# EAGLE design Logic_board (EAGLE 8.2.1)
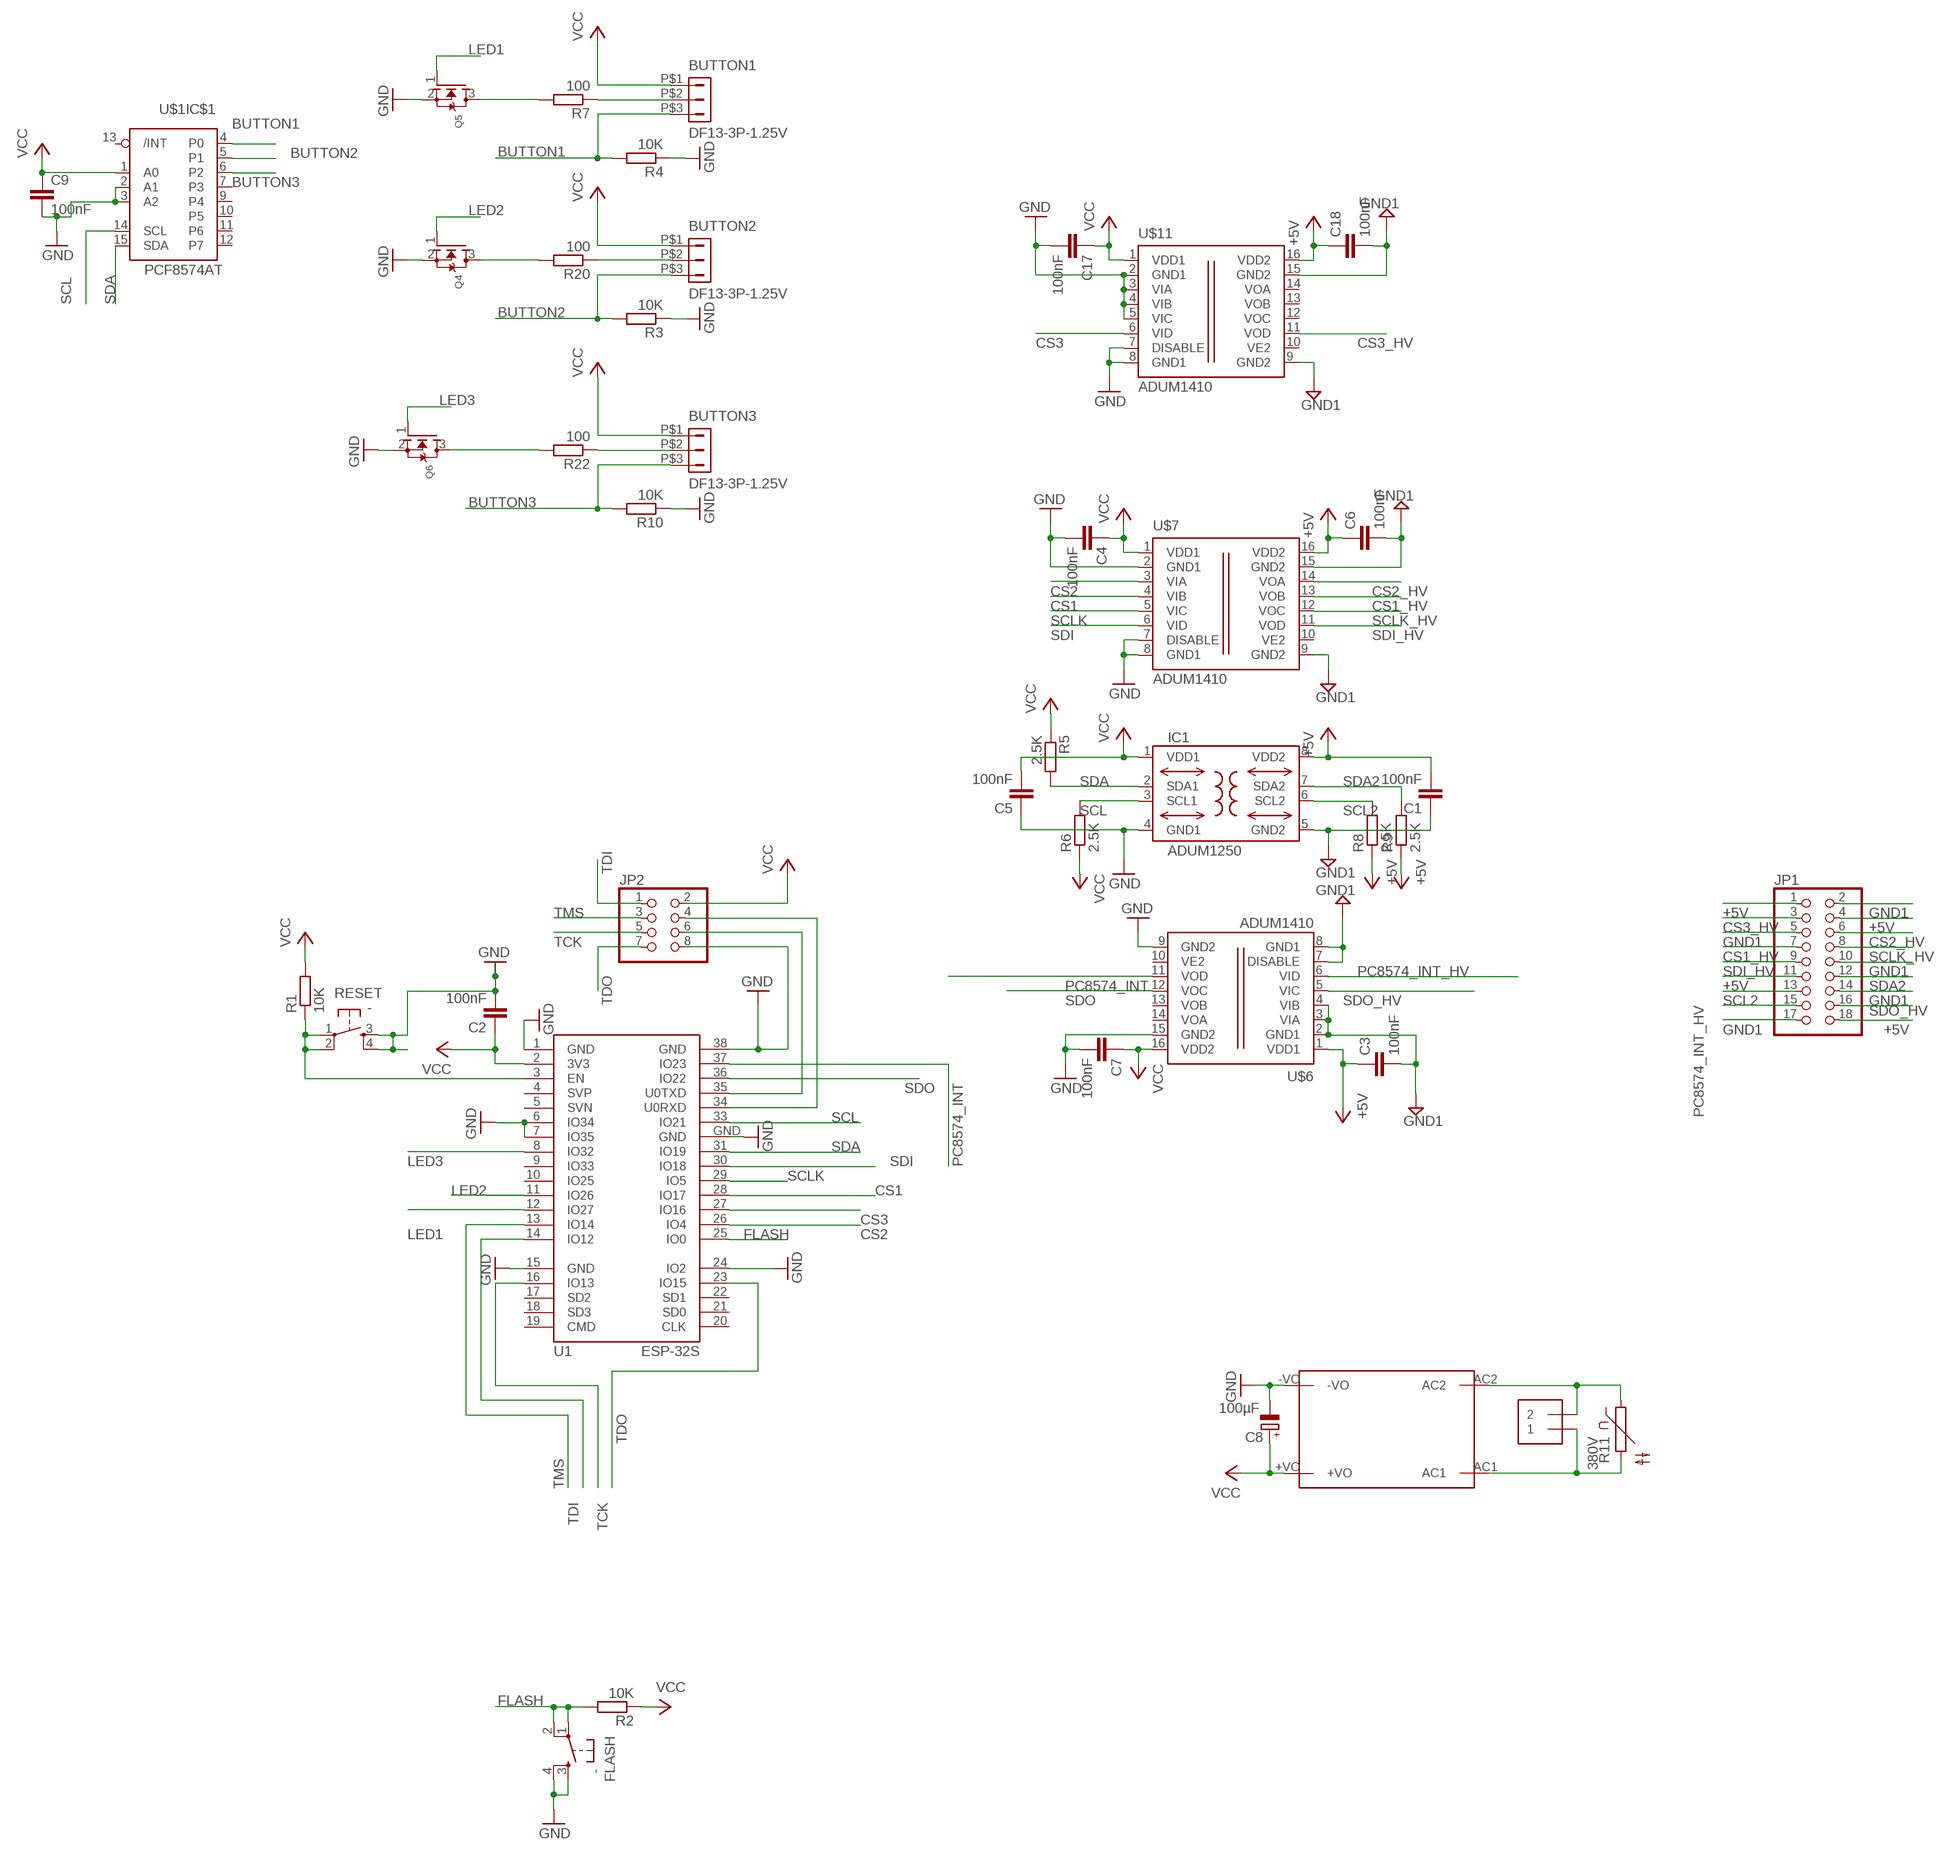
[diagram p0: schematic, sheet 1]

## Parts
BUTTON1  DF13-3P-1.25V  [DF13C-3P-1.25V]
BUTTON2  DF13-3P-1.25V  [DF13C-3P-1.25V]
BUTTON3  DF13-3P-1.25V  [DF13C-3P-1.25V]
C1  100nF  C-EUC0805  [C0805]
C2  100nF  C-EUC0805  [C0805]
C3  100nF  C-EUC0805  [C0805]
C4  100nF  C-EUC0805  [C0805]
C5  100nF  C-EUC0805  [C0805]
C6  100nF  C-EUC0805  [C0805]
C7  100nF  C-EUC0805  [C0805]
C8  100µF  CPOL-EUE2.5-6  [E2,5-6]
C9  100nF  C-EUC0805  [C0805]
C17  100nF  C-EUC0805  [C0805]
C18  100nF  C-EUC0805  [C0805]
FLASH  -  DTSM-6  [DTSM-6]
IC1  ADUM1250  [SO8-COOL]
J1  1X2-3.5MM  [1X2-3.5MM]
JP1  PINHD-2X9  [2X09]
JP2  PINHD-2X4  [2X04]
Q4  MOSFET-NREFLOW  [SOT23]
Q5  MOSFET-NREFLOW  [SOT23]
Q6  MOSFET-NREFLOW  [SOT23]
R1  10K  R-EU_R0805  [R0805]
R2  10K  R-EU_R0805  [R0805]
R3  10K  R-EU_R0805  [R0805]
R4  10K  R-EU_R0805  [R0805]
R5  2.5K  R-EU_R0805  [R0805]
R6  2.5K  R-EU_R0805  [R0805]
R7  100  R-EU_R0805  [R0805]
R8  2.5K  R-EU_R0805  [R0805]
R9  2.5K  R-EU_R0805  [R0805]
R10  10K  R-EU_R0805  [R0805]
R11  380V  S14K11  [S14K11]
R20  100  R-EU_R0805  [R0805]
R22  100  R-EU_R0805  [R0805]
RESET  -  DTSM-6  [DTSM-6]
SUPPLY  5V  HLK-PM03  [HLK-PM03]
U1  ESP-32S  [ESP-32S]
U$1  PCF8574AT  [SO16]
U$6  ADUM1410  [SOIC-16]
U$7  ADUM1410  [SOIC-16]
U$11  ADUM1410  [SOIC-16]

## Nets
+5V: C1.2 C3.1 C6.1 C18.1 IC1.8(VDD2) JP1.1 JP1.4 JP1.11 JP1.18 R8.1 R9.1 U$6.1(VDD1) U$7.16(VDD2) U$11.16(VDD2)
AC1: J1.1 R11.2 SUPPLY.AC1
AC2: J1.2 R11.1 SUPPLY.AC2
BUTTON1: BUTTON1.P$3 R4.2 U$1.4(IC$1:P0)
BUTTON2: BUTTON2.P$3 R3.2 U$1.5(IC$1:P1)
BUTTON3: BUTTON3.P$3 R10.2 U$1.6(IC$1:P2)
CS1: U1.28(IO17) U$7.4(VIB)
CS1_HV: JP1.7 U$7.13(VOB)
CS2: U1.26(IO4) U$7.3(VIA)
CS2_HV: JP1.6 U$7.14(VOA)
CS3: U1.27(IO16) U$11.6(VID)
CS3_HV: JP1.3 U$11.11(VOD)
FLASH: FLASH.1 FLASH.2 R2.2 U1.25(IO0)
GND: C2.2 C4.2 C5.1 C7.2 C8.- C9.2 C17.2 FLASH.3 FLASH.4 IC1.4(GND1) JP2.8 Q4.2(S) Q5.2(S) Q6.2(S) R3.1 R4.1 R10.1 RESET.3 RESET.4 SUPPLY.-VO U1.1(GND) U1.6(IO34) U1.7(IO35) U1.15(GND) U1.24(IO2) U1.38(GND) U1.GND U$1.2(IC$1:A1) U$1.3(IC$1:A2) U$6.9(GND2) U$6.15(GND2) U$7.2(GND1) U$7.7(DISABLE) U$7.8(GND1) U$11.2(GND1) U$11.3(VIA) U$11.4(VIB) U$11.5(VIC) U$11.7(DISABLE) U$11.8(GND1)
GND1: C1.1 C3.2 C6.2 C18.2 IC1.5(GND2) JP1.2 JP1.5 JP1.10 JP1.14 JP1.17 U$6.2(GND1) U$6.3(VIA) U$6.4(VIB) U$6.7(DISABLE) U$6.8(GND1) U$7.9(GND2) U$7.15(GND2) U$11.9(GND2) U$11.15(GND2)
LED1: Q5.1(G) U1.12(IO27)
LED1_SWITCHED: Q5.3(D) R7.2
LED2: Q4.1(G) U1.11(IO26)
LED2_SWITCHED: Q4.3(D) R20.2
LED3: Q6.1(G) U1.8(IO32)
LED3_SWITCHED: Q6.3(D) R22.2
N$7: BUTTON2.P$2 R20.1
N$9: BUTTON1.P$2 R7.1
N$11: BUTTON3.P$2 R22.1
N$66: R1.1 RESET.1 RESET.2 U1.3(EN)
PC8574_INT: U1.37(IO23) U$6.11(VOD)
PC8574_INT_HV: JP1.15 U$6.6(VID)
RX: JP2.4 U1.34(U0RXD)
SCL: IC1.3(SCL1) R6.2 U1.33(IO21) U$1.14(IC$1:SCL)
SCL2: IC1.6(SCL2) JP1.13 R8.2
SCLK: U1.29(IO5) U$7.5(VIC)
SCLK_HV: JP1.8 U$7.12(VOC)
SDA: IC1.2(SDA1) R5.2 U1.31(IO19) U$1.15(IC$1:SDA)
SDA2: IC1.7(SDA2) JP1.12 R9.2
SDI: U1.30(IO18) U$7.6(VID)
SDI_HV: JP1.9 U$7.11(VOD)
SDO: U1.36(IO22) U$6.12(VOC)
SDO_HV: JP1.16 U$6.5(VIC)
TCK: JP2.5 U1.16(IO13)
TDI: JP2.1 U1.14(IO12)
TDO: JP2.7 U1.23(IO15)
TMS: JP2.3 U1.13(IO14)
TX: JP2.6 U1.35(U0TXD)
VCC: BUTTON1.P$1 BUTTON2.P$1 BUTTON3.P$1 C2.1 C4.1 C5.2 C7.1 C8.+ C9.1 C17.1 IC1.1(VDD1) JP2.2 R1.2 R2.1 R5.1 R6.1 SUPPLY.+VO U1.2(3V3) U$1.1(IC$1:A0) U$6.16(VDD2) U$7.1(VDD1) U$11.1(VDD1)
Unconnected: U1.4(SVP) U1.5(SVN) U1.9(IO33) U1.10(IO25) U1.17(SD2) U1.18(SD3) U1.19(CMD) U1.20(CLK) U1.21(SD0) U1.22(SD1) U$1.7(IC$1:P3) U$1.9(IC$1:P4) U$1.10(IC$1:P5) U$1.11(IC$1:P6) U$1.12(IC$1:P7) U$1.13(IC$1:/INT) U$6.10(VE2) U$6.13(VOB) U$6.14(VOA) U$7.10(VE2) U$11.10(VE2) U$11.12(VOC) U$11.13(VOB) U$11.14(VOA)

## Power pins joined to a net without a drawn wire
GND: U$1.8(PWR:GND)
VCC: U$1.16(PWR:VCC)

## Library data of the parts
BUTTON1-BUTTON3 = con-hirose-df13:DF13-3P-1.25: DF13-3P 1.25mm Pitch Miniature Crimping Connector.
C1-C7 C9 C17 C18 = rcl:C-EU: CAPACITOR, European symbol
C8 = rcl:CPOL-EU: POLARIZED CAPACITOR, European symbol
FLASH RESET = switch-tact:DTSM-6
IC1 = analog-devices-3:ADUM1250: Hot Swappable, Dual I2C Isolators Source: http://www.analog.com/static/imported-files/data_sheets/ADUM1250_1251.pdf
J1 = adafruit:1X2: 3.5mm Terminal block http://www.ladyada.net/library/pcb/eaglelibrary.html
JP1 = pinhead:PINHD-2X9: PIN HEADER
JP2 = pinhead:PINHD-2X4: PIN HEADER
Q4-Q6 = adafruit:MOSFET-N: N-Channel Mosfet 2N7002E - 60V 260mA SOT23 [Digikey: 2N7002ET1GOSTR-ND] - REEL BSH103 - 30V 850mA SOT23 [Digikey: 568-5013-1-ND]
R1-R10 R20 R22 = rcl:R-EU_: RESISTOR, European symbol
R11 = varistor:S14K11: VARISTOR
SUPPLY = PowerSocket:HLK-PM03
U1 = esp32:ESP-32S: Ai-Thinker ESP-32S
U$1 = i2c:PCF8574: Remote 8-Bit I/O Expander for I²C Bus
U$6 U$7 U$11 = PowerSocket:ADUM1410

## Board
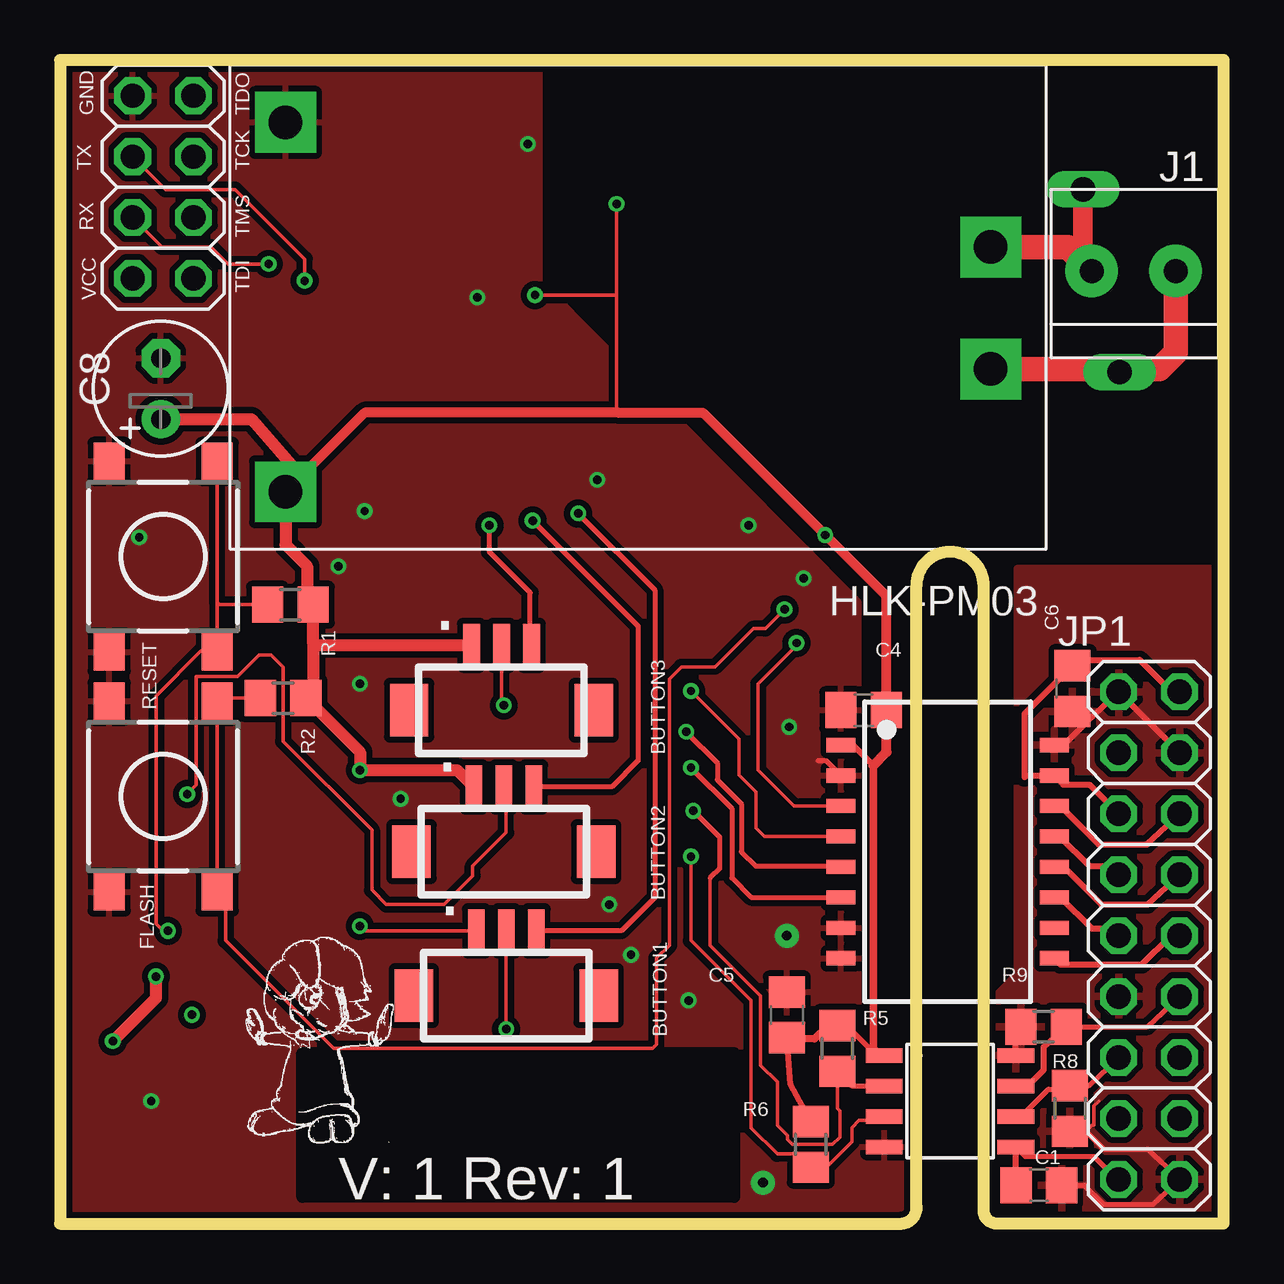
[diagram p1: board, top side]
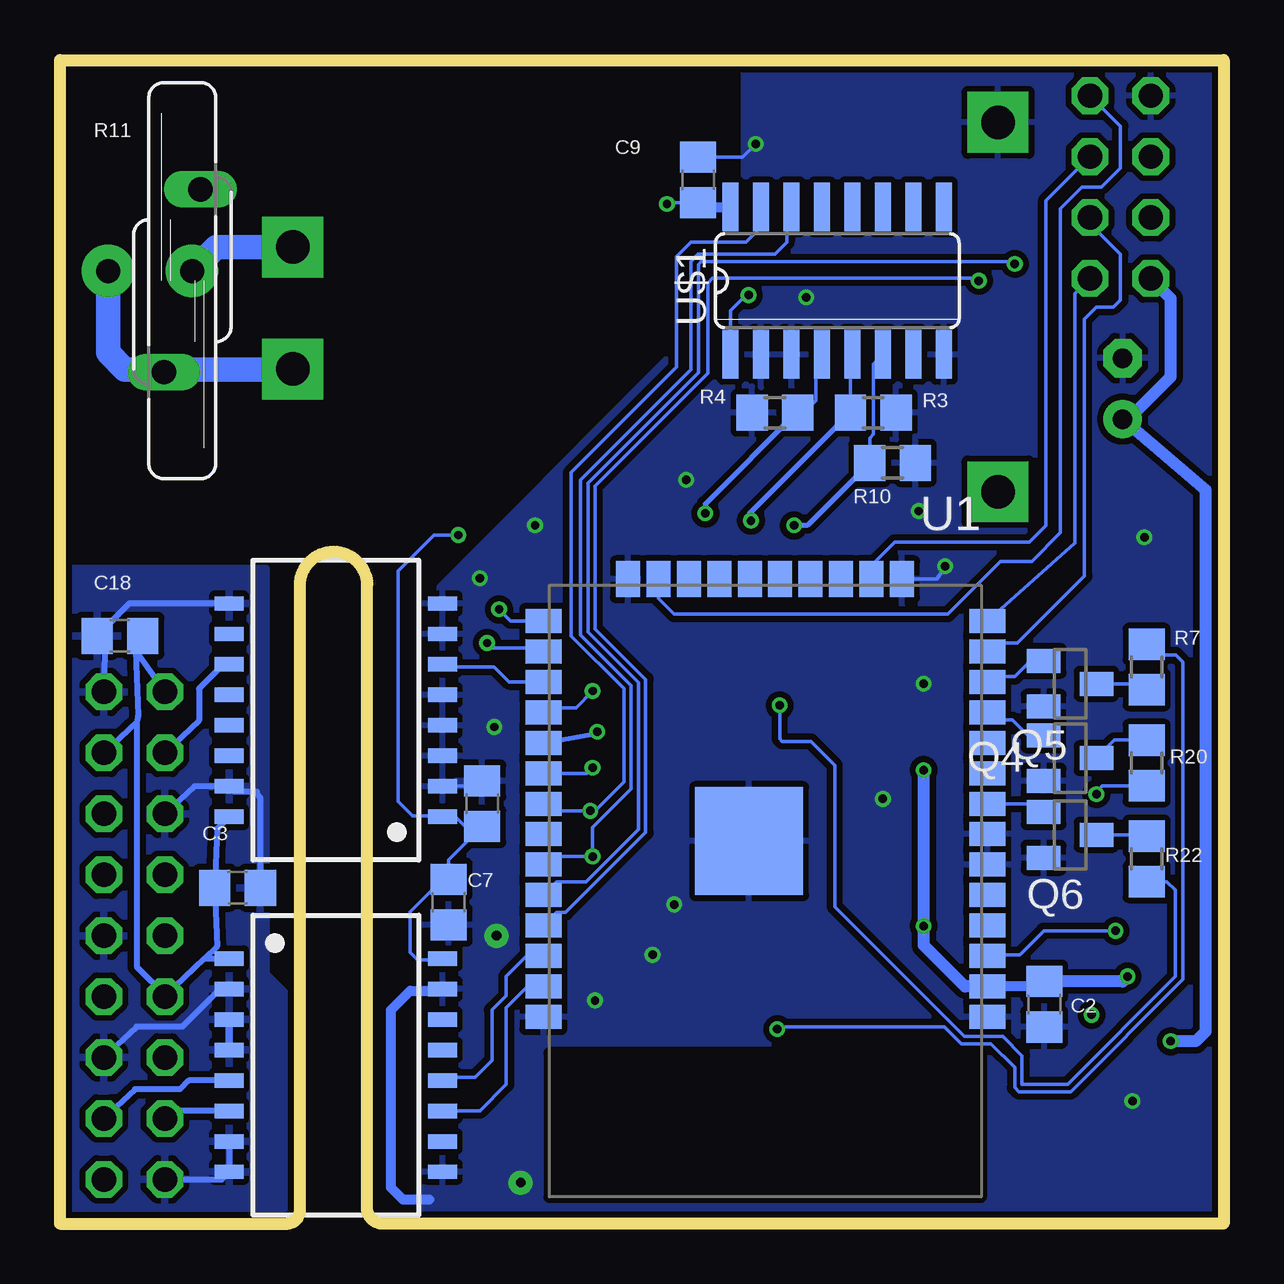
[diagram p2: board, bottom side, seen from below]

Size 48.5 x 48.5 mm. Coordinates in mm from the lower left corner, seen from the top.
Outline: 48.5,0 48.5,48.5 0,48.5 0,0 35.1,0 arc90 35.7,0.7 35.7,26.6 arc-180 38.5,26.6 38.5,0.6 arc90 39,0 48.5,0
Copper layers (1*16): Top 0.035mm / dielectric 1.5mm / Bottom 0.035mm
Design rules "SeeedStudio_2layer_DRU_no_angle_20140221": minimum track width 6mil, minimum drill 12mil, track to track 6mil, track to pad 6mil, pad to pad 6mil, via to via 6mil, smd to smd 0mil, copper to edge 10mil, drill to drill 10mil, minimum pad ring 10mil, minimum via ring 6mil, stop-mask expansion 2mil, vias tented up to drill 100mil, thermal gap 10mil

### Footprints (pad centres in the part's own frame; a part is rotated, then mirrored left to right if it is on the bottom)
DF13C-3P-1.25V = smd 1.6 x 2.2: M$0 3.85,-1.8; M$1 -3.85,-1.8 | smd 0.7 x 1.8: P$1 -1.25,0.9; P$2 0,0.9; P$3 1.25,0.9
C0805 = smd 1.3 x 1.5: 1 -0.95,0; 2 0.95,0
E2,5-6 = drill 0.813 pad 1.6: + -1.27,0 | drill 0.813 pad 1.6 octagon: - 1.27,0
DTSM-6 = smd 1.55 x 1.3: 1 -3.975,2.25; 2 3.975,2.25; 3 -3.975,-2.25; 4 3.975,-2.25
SO8-COOL = smd 0.61 x 1.524: 1 -1.905,-2.743; 2 -0.635,-2.743; 3 0.635,-2.743; 4 1.905,-2.743; 5 1.905,2.743; 6 0.635,2.743; 7 -0.635,2.743; 8 -1.905,2.743
1X2-3.5MM = drill 1 pad 2.184: 1 1.8,0; 2 -1.7,0
2X09 = drill 1.016 octagon: 1 -10.16,-1.27; 2 -10.16,1.27; 3 -7.62,-1.27; 4 -7.62,1.27; 5 -5.08,-1.27; 6 -5.08,1.27; 7 -2.54,-1.27; 8 -2.54,1.27; 9 0,-1.27; 10 0,1.27; 11 2.54,-1.27; 12 2.54,1.27; 13 5.08,-1.27; 14 5.08,1.27; 15 7.62,-1.27; 16 7.62,1.27; 17 10.16,-1.27; 18 10.16,1.27
2X04 = drill 1.016 octagon: 1 -3.81,-1.27; 2 -3.81,1.27; 3 -1.27,-1.27; 4 -1.27,1.27; 5 1.27,-1.27; 6 1.27,1.27; 7 3.81,-1.27; 8 3.81,1.27
SOT23 = smd 1 x 1.4: 1 -0.95,-1.1; 2 0.95,-1.1; 3 0,1.1
R0805 = smd 1.3 x 1.5: 1 -0.95,0; 2 0.95,0
S14K11 = drill 1.016 long: 1 -0.762,-3.81; 2 0.762,3.81
HLK-PM03 = drill 1.4 pad 2.54 square: +VO 29.4,10.2; -VO 29.4,-5.2; AC1 0,5.08; AC2 0,0
ESP-32S = smd 1.5 x 1: 1 -9.25,7; 2 -9.25,5.73; 3 -9.25,4.46; 4 -9.25,3.19; 5 -9.25,1.92; 6 -9.25,0.65; 7 -9.25,-0.62; 8 -9.25,-1.89; 9 -9.25,-3.16; 10 -9.25,-4.43; 11 -9.25,-5.7; 12 -9.25,-6.97; 13 -9.25,-8.24; 14 -9.25,-9.51; 25 9.25,-9.51; 26 9.25,-8.24; 27 9.25,-6.97; 28 9.25,-5.7; 29 9.25,-4.43; 30 9.25,-3.16; 31 9.25,-1.89; 32 9.25,-0.62; 33 9.25,0.65; 34 9.25,1.92; 35 9.25,3.19; 36 9.25,4.46; 37 9.25,5.73; 38 9.25,7 | smd 1 x 1.5: 15 -5.7,-11.25; 16 -4.43,-11.25; 17 -3.16,-11.25; 18 -1.89,-11.25; 19 -0.62,-11.25; 20 0.65,-11.25; 21 1.92,-11.25; 22 3.19,-11.25; 23 4.46,-11.25; 24 5.73,-11.25 | smd 4.5 x 4.5: GND 0.68,-0.33
SO16 = smd 0.66 x 2.032: 1 -4.445,-3.073; 2 -3.175,-3.073; 3 -1.905,-3.073; 4 -0.635,-3.073; 5 0.635,-3.073; 6 1.905,-3.073; 7 3.175,-3.073; 8 4.445,-3.073; 9 4.445,3.073; 10 3.175,3.073; 11 1.905,3.073; 12 0.635,3.073; 13 -0.635,3.073; 14 -1.905,3.073; 15 -3.175,3.073; 16 -4.445,3.073
SOIC-16 = smd 0.6 x 1.2: 1 -4.445,-4.445; 2 -3.175,-4.445; 3 -1.905,-4.445; 4 -0.635,-4.445; 5 0.635,-4.445; 6 1.905,-4.445; 7 3.175,-4.445; 8 4.445,-4.445; 9 4.445,4.445; 10 3.175,4.445; 11 1.905,4.445; 12 0.635,4.445; 13 -0.635,4.445; 14 -1.905,4.445; 15 -3.175,4.445; 16 -4.445,4.445

### Placement (x,y rotation side)
BUTTON1  18.6,11.3 0 top
BUTTON2  18.5,17.3 0 top
BUTTON3  18.4,23.2 0 top
C1  40.8,1.6 0 top
C2  7.47,9.14 270 bottom
C3  41.1,14 0 bottom
C4  33.5,21.4 180 top
C5  30.3,8.7 270 top
C6  42.2,22.3 90 top
C7  32.3,13.4 270 bottom
C8  4.2,34.8 90 top
C9  21.9,43.5 90 bottom
C17  30.9,17.5 90 bottom
C18  46,24.5 180 bottom
FLASH  4.3,17.8 270 top
IC1  37.1,5.1 270 top
J1  44.7,39.7 0 top
JP1  45.4,12 270 top
JP2  4.3,43.2 90 top
Q4  6.4,19.4 270 bottom
Q5  6.4,22.5 270 bottom
Q6  6.4,16.2 270 bottom
R1  9.6,25.8 0 top
R2  9.3,21.9 180 top
R3  14.6,33.8 180 bottom
R4  18.7,33.8 0 bottom
R5  32.4,7.3 270 top
R6  31.3,3.3 270 top
R7  3.2,23.2 270 bottom
R8  42.1,4.8 90 top
R9  41,8.2 0 top
R10  13.8,31.7 180 bottom
R11  43.4,39.3 180 bottom
R20  3.2,19.2 90 bottom
R22  3.2,15.2 90 bottom
RESET  4.3,27.8 270 top
SUPPLY  38.8,40.7 180 top
U1  19.1,15.61 180 bottom
U$1  16.1,39.3 0 bottom
U$6  37,6.6 270 bottom
U$7  37,15.5 270 top
U$11  37,21.4 90 bottom

### Tracks (layer width: path | path; a pad name or v marks a point on that pad's centre or on a via)
+5V
  Top 0.152: 43.3,5.1 43.1,4.9 43.1,4.1 43,4.1 42.75,3.85
  Top 0.2: R8.1 42.75,3.85 43.5,3.1 45.33,3.1 JP1.18 45.55,0.8 43.5,0.8 42.7,1.6 C1.2
  Top 0.254: U$7.16 41.84,19.95 42.8,20.91 | 42.8,20.91 JP1.1 JP1.4 | C6.1 42.65,20.91 42.8,20.91 | IC1.8 39.84,8.09 R9.1
  Bottom 0.254: 42.47,11.04 U$6.1 | 42.47,11.04 JP1.11 44.06,9.46 45.3,10.7 45.3,20.91 | U$11.16 41.95,16.45 C3.1 41.95,11.56 42.47,11.04 | C18.1 45.35,23.86 | 45.35,23.86 JP1.1 | 45.35,23.86 45.25,21.16 45.3,20.91 | 45.3,20.91 JP1.4
  pour Top (isolate 0.254): 68.1,-10.4 39,-10.4 39,9.5 39.9,10.4 39.9,27.3 68.1,27.3
AC1
  Top 0.813: 45.3,35.62 45.3,35.53 R11.2
  Top 1.016: SUPPLY.AC1 45.3,35.62 45.82,35.62 46.5,36.3 J1.1
  Bottom 1.016: J1.1 46.5,36.3 45.8,35.6 38.8,35.6
AC2
  Top 0.813: R11.1 42.64,40.06 J1.2
  Top 1.016: SUPPLY.AC2 42,40.7 J1.2
  Bottom 1.016: SUPPLY.AC2 42,40.7 J1.2
BUTTON1  (via drill 0.35)
  Top 0.2: v21.6,29.6 24.8,26.4 24.8,13.6 23.4,12.2 BUTTON1.P$3
  Bottom 0.152: U$1.4 17,35.96 17,34.3 17.5,33.8 R4.2
  Bottom 0.2: R4.2 17.8,33.8 21.6,30 v21.6,29.6
BUTTON2  (via drill 0.35)
  Top 0.2: v19.7,29.3 24.1,24.9 24.1,19.3 23,18.2 BUTTON2.P$3
  Bottom 0.152: U$1.5 15.55,36.14 R3.2
  Bottom 0.2: R3.2 19.8,29.55 19.8,29.5 19.7,29.4 v19.7,29.3
BUTTON3  (via drill 0.35)
  Top 0.2: BUTTON3.P$3 19.6,24.15 19.6,26.3 17.9,28 v17.9,29.1
  Bottom 0.152: U$1.6 14.6,35.82 14.6,32.9 14.75,32.75 R10.2
  Bottom 0.2: R10.2 17.35,29.1 v17.9,29.1 | v17.9,29.1 18,29.1 v17.9,29.1
CS1  (via drill 0.35)
  Top 0.152: v26.3,22.2 28.3,20.2 28.3,18.7 29,18 29,16.5 29.36,16.14 U$7.4
  Bottom 0.152: 28.06,21.6 U1.28 28.16,21.5 27,21.5 v26.3,22.2
CS1_HV
  Top 0.254: U$7.13 41.66,16.14 42.9,14.9 43.69,14.9 JP1.7
CS2  (via drill 0.35)
  Top 0.152: v30.7,24.2 30.7,24.1 29.1,22.5 29.1,18.9 30.59,17.41 U$7.3
  Top 0.254: U$7.3
  Bottom 0.152: U1.26 28.2,24 30.5,24 v30.7,24.2 30.8,24.3
CS2_HV
  Top 0.254: U$7.14 41.7,17.41 43.3,15.8 45.31,15.8 JP1.6
CS3
  Bottom 0.152: U$11.6 32.45,23.2 30.4,23.2 29.78,22.58 U1.27
CS3_HV
  Bottom 0.254: U$11.11 41.7,23.3 42.7,22.3 42.7,20.97 JP1.3
FLASH  (via drill 0.35)
  Top 0.152: v30.2,25.6 29.4,24.8 28.9,24.8 27.3,23.2 25.9,23.2 25.4,22.7 25.4,11.6 24.86,11.06 24.86,7.46 24.7,7.3 11.4,7.3 6.9,11.8 6.9,13.47 FLASH.2 FLASH.1 6.55,21.9 R2.2
  Bottom 0.152: U1.25 29.72,25.12 v30.2,25.6
GND  (via drill 0.35, 0.4 pad 1)
  Top 0.2: 31.6,19.3 31.93,19.3 32.53,18.7
  Top 0.406: 32.53,18.7 U$7.2
  Bottom 0.152: 32.53,18.25 31.1,18.25 C17.2 | U1.15 11.94,26.86 v11.6,27.4 | C9.2 20.05,44.45 v19.5,45
  Bottom 0.254: U$11.2 32.53,18.25
  Bottom 0.406: 33.1,1 34.2,1 34.7,1.5 34.7,8.9 33.9,9.7 32.4,9.7
  other vias: 29.3,1.7 30.3,12 12.7,29.7 22.4,31 17.4,38.6 30.4,20.7 31,26.9 28.7,29.1 14.2,17.7 22.9,13.3 23.8,11.2 26.2,9.3 3.8,5.1 3.3,28.6 12.5,22.5
  pour Top (isolate 0.254): -52.8,-13.6 35.2,-13.6 35.2,6.5 33.3,6.5 33.3,25.9 20,39.3 20,49.8 -52.8,52.6
  pour Bottom (isolate 0.254): -60.7,-16.8 33.3,-16.8 33.3,25.9 20,39.3 20,49.4 19.2,49.4 -60.7,51.3
GND1
  Top 0.2: 40.3,3.19 IC1.5 40.24,2.8 43.1,2.8 44.05,1.85 JP1.17 | 46.52,6.92 JP1.14
  Top 0.254: U$7.9 41.7,10.8 45.1,10.8 46.3,12 JP1.10 | JP1.5 44.05,17.15 42.9,18.3 41.82,18.3 U$7.15 40.27,18.68 40.2,18.6 40.2,21.25 C6.2 42.45,23.5 45,23.5 46.34,22.16 JP1.2 | IC1.5 C1.1
  Bottom 0.254: U$6.7 U$6.8 41.76,1.84 JP1.17 | U$6.2 41.83,9.78 43.4,8.2 45.31,8.2 JP1.14 | C3.2 40.15,17.75 40.3,18 41.22,18 U$11.15 42.91,18.23 JP1.5 | JP1.2 46.59,24.14 C18.2 45.6,25.84 U$11.9
  Bottom 0.305: U$6.4 U$6.3
  pour Bottom (isolate 0.254): 39,-2.4 39,9.5 39.9,10.4 39.9,27.3 61.7,27.3 61.7,-2.4
LED1
  Bottom 0.152: Q5.1 8.05,23.45 8.7,22.8 9.63,22.8 U1.12
LED1_SWITCHED
  Bottom 0.152: Q5.3 3.45,22.5 R7.2
LED2
  Bottom 0.152: Q4.1 8.15,20.35 8.8,21 9.54,21 U1.11
LED2_SWITCHED
  Bottom 0.152: Q4.3 4.55,20.15 R20.2
LED3
  Bottom 0.152: U1.8 7.85,17.5 Q6.1
LED3_SWITCHED
  Bottom 0.152: R22.2 3.25,16.2 Q6.3
N$7  (via drill 0.35)
  Top 0.152: v5.3,17.9 5.67,18.27 5.67,22.8 7.4,22.8 8.3,23.7 8.8,23.7 9.3,23.2 9.3,20.1 13,16.4 13,13.9 13.6,13.3 16,13.3 17.2,14.5 17.2,14.9 18.6,16.3 18.6,18.1 BUTTON2.P$2
  Bottom 0.152: R20.1 5.05,18.25 5.3,18 v5.3,17.9
N$9  (via drill 0.35)
  Top 0.152: BUTTON1.P$2 v18.6,8.1
  Bottom 0.152: R7.1 2.75,23.7 2,23.7 1.7,23.4 1.7,10.17 6.37,5.5 8.53,5.5 8.71,5.67 8.71,6.5 9.7,7.5 10.93,7.5 11.63,8.2 18.5,8.2 v18.6,8.1
N$10  (via drill 0.35)
  other vias: 5.5,8.7
N$11  (via drill 0.35)
  Top 0.152: v18.5,21.6 18.4,21.7 BUTTON3.P$2
  Bottom 0.152: R22.1 2.35,14.25 2,13.9 2,10.29 6.5,5.8 8.4,5.8 8.4,7 9.2,7.8 10.8,7.8 16.2,13.2 16.2,19.1 17.2,20.1 18.4,20.1 18.5,20.2 v18.5,21.6
N$66  (via drill 0.35)
  Top 0.152: 6.55,25.9 RESET.1 | 6.55,25.9 RESET.2 6.55,23.93 6.31,24.17 5.85,23.85 4,22 4,12.5 4.3,12.2 v4.5,12.2 | R1.1 6.65,25.8 6.55,25.9
  Bottom 0.152: v4.5,12.2 7.5,12.2 8.5,11.2 9.8,11.2 U1.3
PC8574_INT
  Bottom 0.152: U1.37 29.02,9.88 29.9,9 29.9,5.8 31,4.7 U$6.11
PC8574_INT_HV
  Bottom 0.254: U$6.6 43.73,4.7 JP1.15
RX  (via drill 0.35)
  Top 0.152: v8.7,40 7,40 6.3,40.7 4.26,40.7 JP2.4
  Bottom 0.152: U1.34 27.81,14.23 26.58,14.23 24.39,16.42 24.39,22.55 26.5,24.66 26.5,30.87 21.89,35.47 21.89,39.97 21.77,40.09 8.79,40.09 v8.7,40
SCL  (via drill 0.35)
  Top 0.152: IC1.3 34.19,4.3 33.3,4.3 33,4 33,3.4 31.85,2.25 R6.2 30.75,2.9 29.9,2.9 28.8,4 28.8,9.3 26.3,11.8 v26.3,15.3
  Bottom 0.152: U1.33 28.01,15.3 v26.3,15.3 26.3,16.51 24.7,18.12 24.7,22.43 26.8,24.53 26.8,31 22.2,35.6 22.2,40.1 21.9,40.4 18.7,40.4 18.2,40.9 18.2,42.18 U$1.14
SCL2
  Top 0.2: IC1.6 40.06,4.46 41.2,5.6 41.55,5.6 41.85,5.9 | R8.2 42.88,5.75 JP1.13
  Top 0.254: 39.97,4.46 IC1.6 | 41.85,5.9 R8.2
SCLK  (via drill 0.35)
  Top 0.2: v26.1,20.5 27.4,19.2 27.4,18.5 28.4,17.5 28.4,15.5 29,14.9 32.52,14.9 U$7.5
  Bottom 0.2: U1.29 26.04,20.44 v26.1,20.5
SCLK_HV
  Top 0.254: U$7.12 41.84,14.87 43.4,13.3 45.35,13.3 JP1.8
SDA  (via drill 0.35)
  Top 0.152: 27.1,14.4 27.1,11.6 29.2,9.5 29.2,6.6 29.9,5.9 29.9,4.1 30.32,3.68 30.32,3.5 30.53,3.3 32.2,3.3 32.5,3.6 32.5,4.7 32.4,4.8 R5.2
  Top 0.2: 27.1,14.4 27.5,14.8 27.5,16.1 v26.4,17.2 | R5.2 33.02,5.74 IC1.2
  Bottom 0.152: U1.31 28.05,17.2 v26.4,17.2 26.2,17.2 25,18.4 25,22.3 27.2,24.5 27.2,31.3 22.8,35.7 22.8,40.3 22.2,40.9 19.9,40.9 19.27,41.52 U$1.15
SDA2
  Top 0.2: R9.2 45.33,8.2 JP1.12
  Top 0.254: IC1.7 40.34,5.74 41,6.4 41,7.35 R9.2
SDI  (via drill 0.35)
  Top 0.2: v26.3,19 28,17.3 28,14.4 28.8,13.6 U$7.6
  Bottom 0.152: U1.30 26.53,18.77 v26.3,19
SDI_HV
  Top 0.254: U$7.11 41.7,13.6 43,12.3 43.75,12.3 JP1.9
SDO
  Bottom 0.152: U1.36 29.05,11.15 29.9,10.3 29.9,9.5 30.5,8.9 30.5,6.8 31.2,6.1 32.29,6.1 32.49,5.9
  Bottom 0.2: 32.49,5.9 U$6.12
SDO_HV
  Bottom 0.254: U$6.5 43.13,5.96 43.5,5.6 45.37,5.6 JP1.16
TCK
  Bottom 0.152: U1.16 14.67,27.43 13.7,28.4 8.1,28.4 7.4,29.1 7.4,42.64 JP2.5
TDI
  Bottom 0.152: U1.14 6.2,28.37 6.2,38.76 JP2.1
TDO
  Bottom 0.152: U1.23 23.56,26.06 22.9,25.4 11.5,25.4 9.3,27.6 8,27.6 6.8,28.8 6.8,42.3 5.9,43.2 5.1,43.2 4.3,44 4.3,45.74 JP2.7
TMS
  Bottom 0.152: U1.13 9.5,24.2 8.6,24.2 5.8,27 5.8,37.7 5.3,38.2 4.6,38.2 4.3,38.5 4.3,40.4 5.57,41.67 JP2.3
TX  (via drill 0.35)
  Top 0.152: v10.2,39.3 10.2,40.2 7.3,43.1 4.4,43.1 JP2.6
  Bottom 0.152: U1.35 27.81,12.96 27.42,12.96 24.09,16.3 24.09,22.68 26.19,24.78 26.19,30.75 21.67,35.27 | 21.67,35.27 25.92,31.02 | 21.67,35.27 21.59,35.35 | v10.2,39.3 10.3,39.4 21.3,39.4 21.5,39.2 21.5,35.44 21.67,35.27
VCC  (via drill 0.35)
  Top 0.152: 32.4,20.1 U$7.1 | 23.2,38.7 v23.2,42.5 | 23.2,38.7 23.2,33.9 23.3,33.8 | v19.8,38.7 23.2,38.7 | 10.38,22.09 10.55,22.26 | BUTTON1.P$1 12.5,12.2 v12.5,12.4
  Top 0.2: 32,8.25 R5.1 32.8,8.25 33.95,7.1 | R1.2 10.5,25.8
  Top 0.254: U$7.1 33.05,19.95 33.9,19.1 | IC1.1 34.24,7 33.9,7.35 33.95,7.1 | R6.1 30.45,5.8 C5.2
  Top 0.305: 33.9,7.35 33.9,19.1 | C5.2 31.45,7.7 32,8.25
  Top 0.406: SUPPLY.+VO 10.05,31.15 12.7,33.8 23.3,33.8 26.8,33.8 v31.9,28.7 34.45,26.15 C4.1 34.45,19.65 33.9,19.1
  Top 0.508: C8.+ 7.98,33.52 10.05,31.15 | v2.2,7.6 4,9.4 v4,10.3 | 10.55,24.2 R1.2 | 10.55,24.2 10.55,22.26 | 10.38,22.09 10.25,21.96 R2.1 12.5,19.65 v12.5,18.9 16.55,18.9 BUTTON2.P$1 | BUTTON3.P$1 10.65,24.1 10.55,24.2 | 9.4,30.4 9.4,28.3 10.3,27.4 10.3,26 10.5,25.8
  Bottom 0.152: 31.4,16.35 32.01,16.95 U$11.1 32.6,17 33.8,17 34.4,17.6 34.4,27.2 32.9,28.7 v31.9,28.7 | C17.1 32.3,15.15 C7.1 32.55,14.35 33.9,13 33.9,11.3 33.6,11 32.6,11 U$6.16 | C9.1 23.15,42.55 v23.2,42.5 23.3,42.4 | U$1.1 20.55,38.05 19.8,38.8 v19.8,38.7
  Bottom 0.254: C17.1 31.4,16.35
  Bottom 0.305: C8.+ 3.87,33.53
  Bottom 0.406: U1.2 7.68,9.88 C2.1 7.43,10.05 | C9.1 21.72,42.37 U$1.16
  Bottom 0.508: U1.2 10.78,9.88 12.5,11.6 v12.5,12.4 v12.5,18.9 | C8.+ 0.76,30.59 0.76,8 1.16,7.6 v2.2,7.6 | v4,10.3 4.21,10.09 C2.1 | 3.87,33.53 3.87,33.63 2.2,35.3 2.2,38.56 JP2.2

### Text on the board
tPlace: GND | TDO | TX | TCK | RX | TMS | TDI | VCC | BUTTON3 | BUTTON2 | BUTTON1 | V: 1 Rev: 1